# Altium project Bonjour.PrjPcb
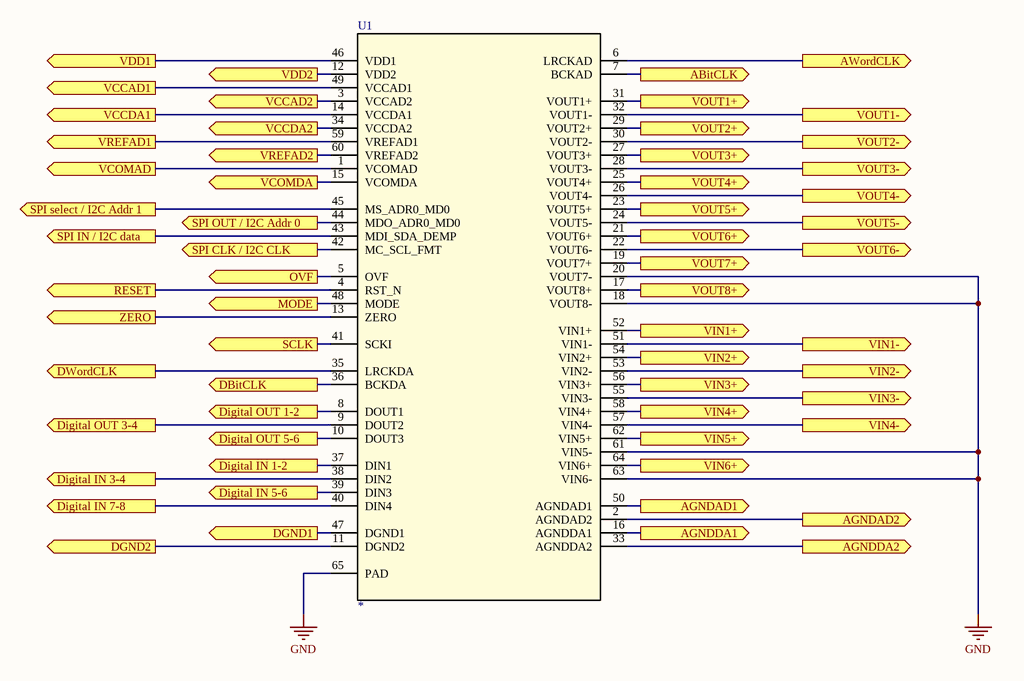
[diagram p0: Sh_ADC-DAC_Main.SchDoc]
4 sheets, 88 parts. Net scope: flat (ports and power ports of the same name join across sheets).
Board file: PCB_Bonjour.PcbDoc
Sheets:
  Sh_ADC-DAC_Main.SchDoc
  Sh_Headers.SchDoc
  Sh_Inputs_Analog.SchDoc
  Sh_Outputs_Analog.SchDoc

## Sheet Sh_ADC-DAC_Main.SchDoc
size A4

### Parts
U1  *  [PAP0064J_N]

### Ports
ABitCLK (out), AGNDAD1 (out), AGNDAD2 (out), AGNDDA1 (out), AGNDDA2 (out), AWordCLK (out), DBitCLK (out), DGND1 (out), DGND2 (out), Digital IN 1-2 (out), Digital IN 3-4 (out), Digital IN 5-6 (out), Digital IN 7-8 (out), Digital OUT 1-2 (out), Digital OUT 3-4 (out), Digital OUT 5-6 (out), DWordCLK (out), MODE (out), OVF (out), RESET (out), SCLK (out), SPI CLK / I2C CLK (out), SPI IN / I2C data (out), SPI OUT / I2C Addr 0 (out), SPI select / I2C Addr 1 (out), VCCAD1 (out), VCCAD2 (out), VCCDA1 (out), VCCDA2 (out), VCOMAD (out), VCOMDA (out), VDD1 (out), VDD2 (out), VIN1+ (out), VIN1- (out), VIN2+ (out), VIN2- (out), VIN3+ (out), VIN3- (out), VIN4+ (out), VIN4- (out), VIN5+ (out), VIN6+ (out), VOUT1+ (out), VOUT1- (out), VOUT2+ (out), VOUT2- (out), VOUT3+ (out), VOUT3- (out), VOUT4+ (out), VOUT4- (out), VOUT5+ (out), VOUT5- (out), VOUT6+ (out), VOUT6- (out), VOUT7+ (out), VOUT8+ (out), VREFAD1 (out), VREFAD2 (out), ZERO (out)

### Nets
GND: U1.18(VOUT8-) U1.20(VOUT7-) U1.61(VIN5-) U1.63(VIN6-) U1.65(PAD)
NetC3_1: U1.52(VIN1+) ; port VIN1+
NetC3_2: U1.51(VIN1-) ; port VIN1-
NetC4_1: U1.54(VIN2+) ; port VIN2+
NetC4_2: U1.53(VIN2-) ; port VIN2-
NetC7#2_1: U1.19(VOUT7+) ; port VOUT7+
NetC8#2_1: U1.17(VOUT8+) ; port VOUT8+
NetC9_1: U1.1(VCOMAD) ; port VCOMAD
NetC13_1: U1.56(VIN3+) ; port VIN3+
NetC13_2: U1.55(VIN3-) ; port VIN3-
NetC15_1: U1.58(VIN4+) ; port VIN4+
NetC15_2: U1.57(VIN4-) ; port VIN4-
NetD27_1: U1.27(VOUT3+) ; port VOUT3+
NetD28_1: U1.25(VOUT4+) ; port VOUT4+
NetD29_1: U1.23(VOUT5+) ; port VOUT5+
NetD30_1: U1.21(VOUT6+) ; port VOUT6+
NetP1_5: U1.7(BCKAD) ; port ABitCLK
NetP1_6: U1.6(LRCKAD) ; port AWordCLK
NetP2_1: U1.37(DIN1) ; port Digital IN 1-2
NetP2_2: U1.38(DIN2) ; port Digital IN 3-4
NetP2_3: U1.39(DIN3) ; port Digital IN 5-6
NetP2_4: U1.40(DIN4) ; port Digital IN 7-8
NetP2_5: U1.36(BCKDA) ; port DBitCLK
NetP2_6: U1.35(LRCKDA) ; port DWordCLK
NetP2_7: U1.8(DOUT1) ; port Digital OUT 1-2
NetP2_8: U1.9(DOUT2) ; port Digital OUT 3-4
NetP2_9: U1.10(DOUT3) ; port Digital OUT 5-6
NetP3_2: U1.62(VIN5+) ; port VIN5+
NetP4_2: U1.64(VIN6+) ; port VIN6+
NetP5_1: U1.5(OVF) ; port OVF
NetP5_2: U1.13(ZERO) ; port ZERO
NetP5_3: U1.4(RST_N) ; port RESET
NetP5_4: U1.48(MODE) ; port MODE
NetP5_5: U1.41(SCKI) ; port SCLK
NetP6_1: U1.45(MS_ADR0_MD0) ; port SPI select / I2C Addr 1
NetP6_2: U1.44(MDO_ADR0_MD0) ; port SPI OUT / I2C Addr 0
NetP6_3: U1.43(MDI_SDA_DEMP) ; port SPI IN / I2C data
NetP6_4: U1.42(MC_SCL_FMT) ; port SPI CLK / I2C CLK
NetR26_1: U1.32(VOUT1-) ; port VOUT1-
NetR29_1: U1.31(VOUT1+) ; port VOUT1+
NetR34_1: U1.30(VOUT2-) ; port VOUT2-
NetR36_1: U1.29(VOUT2+) ; port VOUT2+
NetU1_2: U1.2(AGNDAD2) ; port AGNDAD2
NetU1_3: U1.3(VCCAD2) ; port VCCAD2
NetU1_11: U1.11(DGND2) ; port DGND2
NetU1_12: U1.12(VDD2) ; port VDD2
NetU1_14: U1.14(VCCDA1) ; port VCCDA1
NetU1_15: U1.15(VCOMDA) ; port VCOMDA
NetU1_16: U1.16(AGNDDA1) ; port AGNDDA1
NetU1_22: U1.22(VOUT6-) ; port VOUT6-
NetU1_24: U1.24(VOUT5-) ; port VOUT5-
NetU1_26: U1.26(VOUT4-) ; port VOUT4-
NetU1_28: U1.28(VOUT3-) ; port VOUT3-
NetU1_33: U1.33(AGNDDA2) ; port AGNDDA2
NetU1_34: U1.34(VCCDA2) ; port VCCDA2
NetU1_46: U1.46(VDD1) ; port VDD1
NetU1_47: U1.47(DGND1) ; port DGND1
NetU1_49: U1.49(VCCAD1) ; port VCCAD1
NetU1_50: U1.50(AGNDAD1) ; port AGNDAD1
NetU1_59: U1.59(VREFAD1) ; port VREFAD1
NetU1_60: U1.60(VREFAD2) ; port VREFAD2

### Notes on the sheet
- (in symbol PCM3168APAPR) DAC; ADC

### Library data of the parts
U1 = PCM3168APAPR: Imported; Manufacturer: Texas Instruments; PartNumber: PCM3168APAPR; RefDes: RefDes; TYPE: TYPE; Value: Value

## Sheet Sh_Headers.SchDoc
size A4
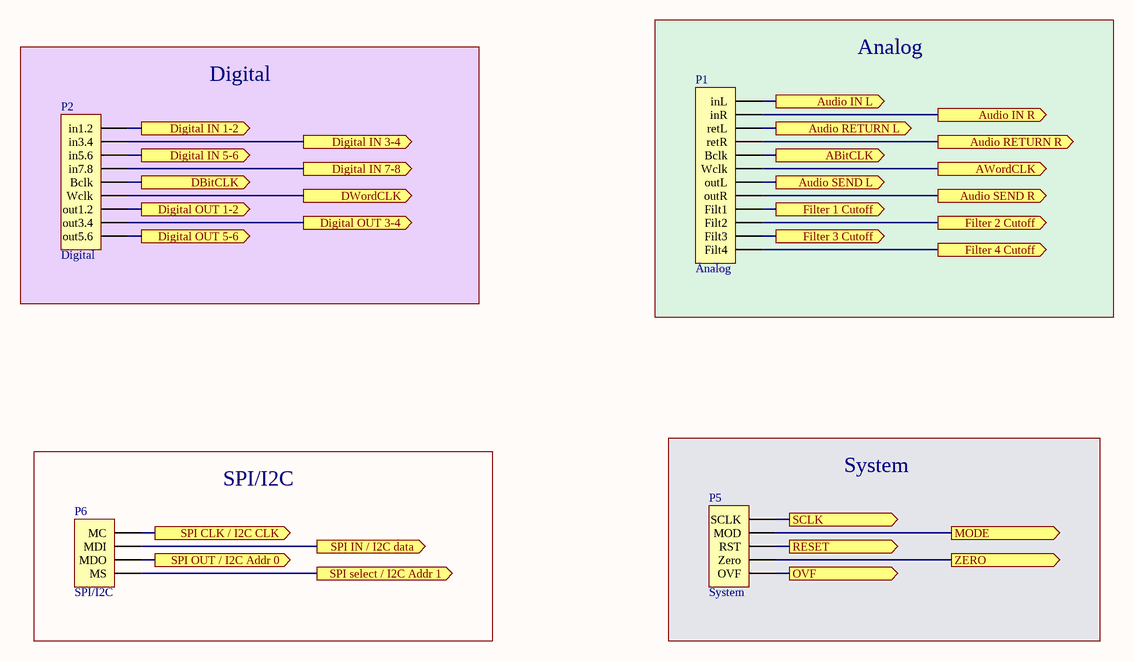
[diagram p1: Sh_Headers.SchDoc]

### Parts
P1  Analog  [HDR1X12]
P2  Digital  [HDR1X9]
P5  System  [HDR1X5]
P6  SPI/I2C  [HDR1X4]

### Blocks framed on the sheet
Digital: P2
Analog: P1
SPI/I2C: P6
System: P5

### Ports
ABitCLK (out), Audio IN L (out), Audio IN R (out), Audio RETURN L (out), Audio RETURN R (out), Audio SEND L (out), Audio SEND R (out), AWordCLK (out), DBitCLK (out), Digital IN 1-2 (out), Digital IN 3-4 (out), Digital IN 5-6 (out), Digital IN 7-8 (out), Digital OUT 1-2 (out), Digital OUT 3-4 (out), Digital OUT 5-6 (out), DWordCLK (out), Filter 1 Cutoff (out), Filter 2 Cutoff (out), Filter 3 Cutoff (out), Filter 4 Cutoff (out), MODE (out), OVF (out), RESET (out), SCLK (out), SPI CLK / I2C CLK (out), SPI IN / I2C data (out), SPI OUT / I2C Addr 0 (out), SPI select / I2C Addr 1 (out), ZERO (out)

### Nets
NetC7#1_2: P1.1(inL) ; port Audio IN L
NetC8#1_2: P1.2(inR) ; port Audio IN R
NetC14_2: P1.4(retR) ; port Audio RETURN R
NetC18_2: P1.3(retL) ; port Audio RETURN L
NetP1_5: P1.5(Bclk) ; port ABitCLK
NetP1_6: P1.6(Wclk) ; port AWordCLK
NetP1_7: P1.7(outL) ; port Audio SEND L
NetP1_8: P1.8(outR) ; port Audio SEND R
NetP1_9: P1.9(Filt1) ; port Filter 1 Cutoff
NetP1_10: P1.10(Filt2) ; port Filter 2 Cutoff
NetP1_11: P1.11(Filt3) ; port Filter 3 Cutoff
NetP1_12: P1.12(Filt4) ; port Filter 4 Cutoff
NetP2_1: P2.1(in1.2) ; port Digital IN 1-2
NetP2_2: P2.2(in3.4) ; port Digital IN 3-4
NetP2_3: P2.3(in5.6) ; port Digital IN 5-6
NetP2_4: P2.4(in7.8) ; port Digital IN 7-8
NetP2_5: P2.5(Bclk) ; port DBitCLK
NetP2_6: P2.6(Wclk) ; port DWordCLK
NetP2_7: P2.7(out1.2) ; port Digital OUT 1-2
NetP2_8: P2.8(out3.4) ; port Digital OUT 3-4
NetP2_9: P2.9(out5.6) ; port Digital OUT 5-6
NetP5_1: P5.1(OVF) ; port OVF
NetP5_2: P5.2(Zero) ; port ZERO
NetP5_3: P5.3(RST) ; port RESET
NetP5_4: P5.4(MOD) ; port MODE
NetP5_5: P5.5(SCLK) ; port SCLK
NetP6_1: P6.1(MS) ; port SPI select / I2C Addr 1
NetP6_2: P6.2(MDO) ; port SPI OUT / I2C Addr 0
NetP6_3: P6.3(MDI) ; port SPI IN / I2C data
NetP6_4: P6.4(MC) ; port SPI CLK / I2C CLK

### Library data of the parts
P1 = Header 12: Header, 12-Pin; LatestRevisionDate: 17-Jul-2002; LatestRevisionNote: Re-released for DXP Platform.; Publisher: Altium Limited
P2 = Header 9: Header, 9-Pin; LatestRevisionDate: 17-Jul-2002; LatestRevisionNote: Re-released for DXP Platform.; Publisher: Altium Limited
P5 = Header 5: Header, 5-Pin; LatestRevisionDate: 17-Jul-2002; LatestRevisionNote: Re-released for DXP Platform.; Publisher: Altium Limited
P6 = Header 4: Header, 4-Pin; LatestRevisionDate: 17-Jul-2002; LatestRevisionNote: Re-released for DXP Platform.; Publisher: Altium Limited

## Sheet Sh_Inputs_Analog.SchDoc
size A3
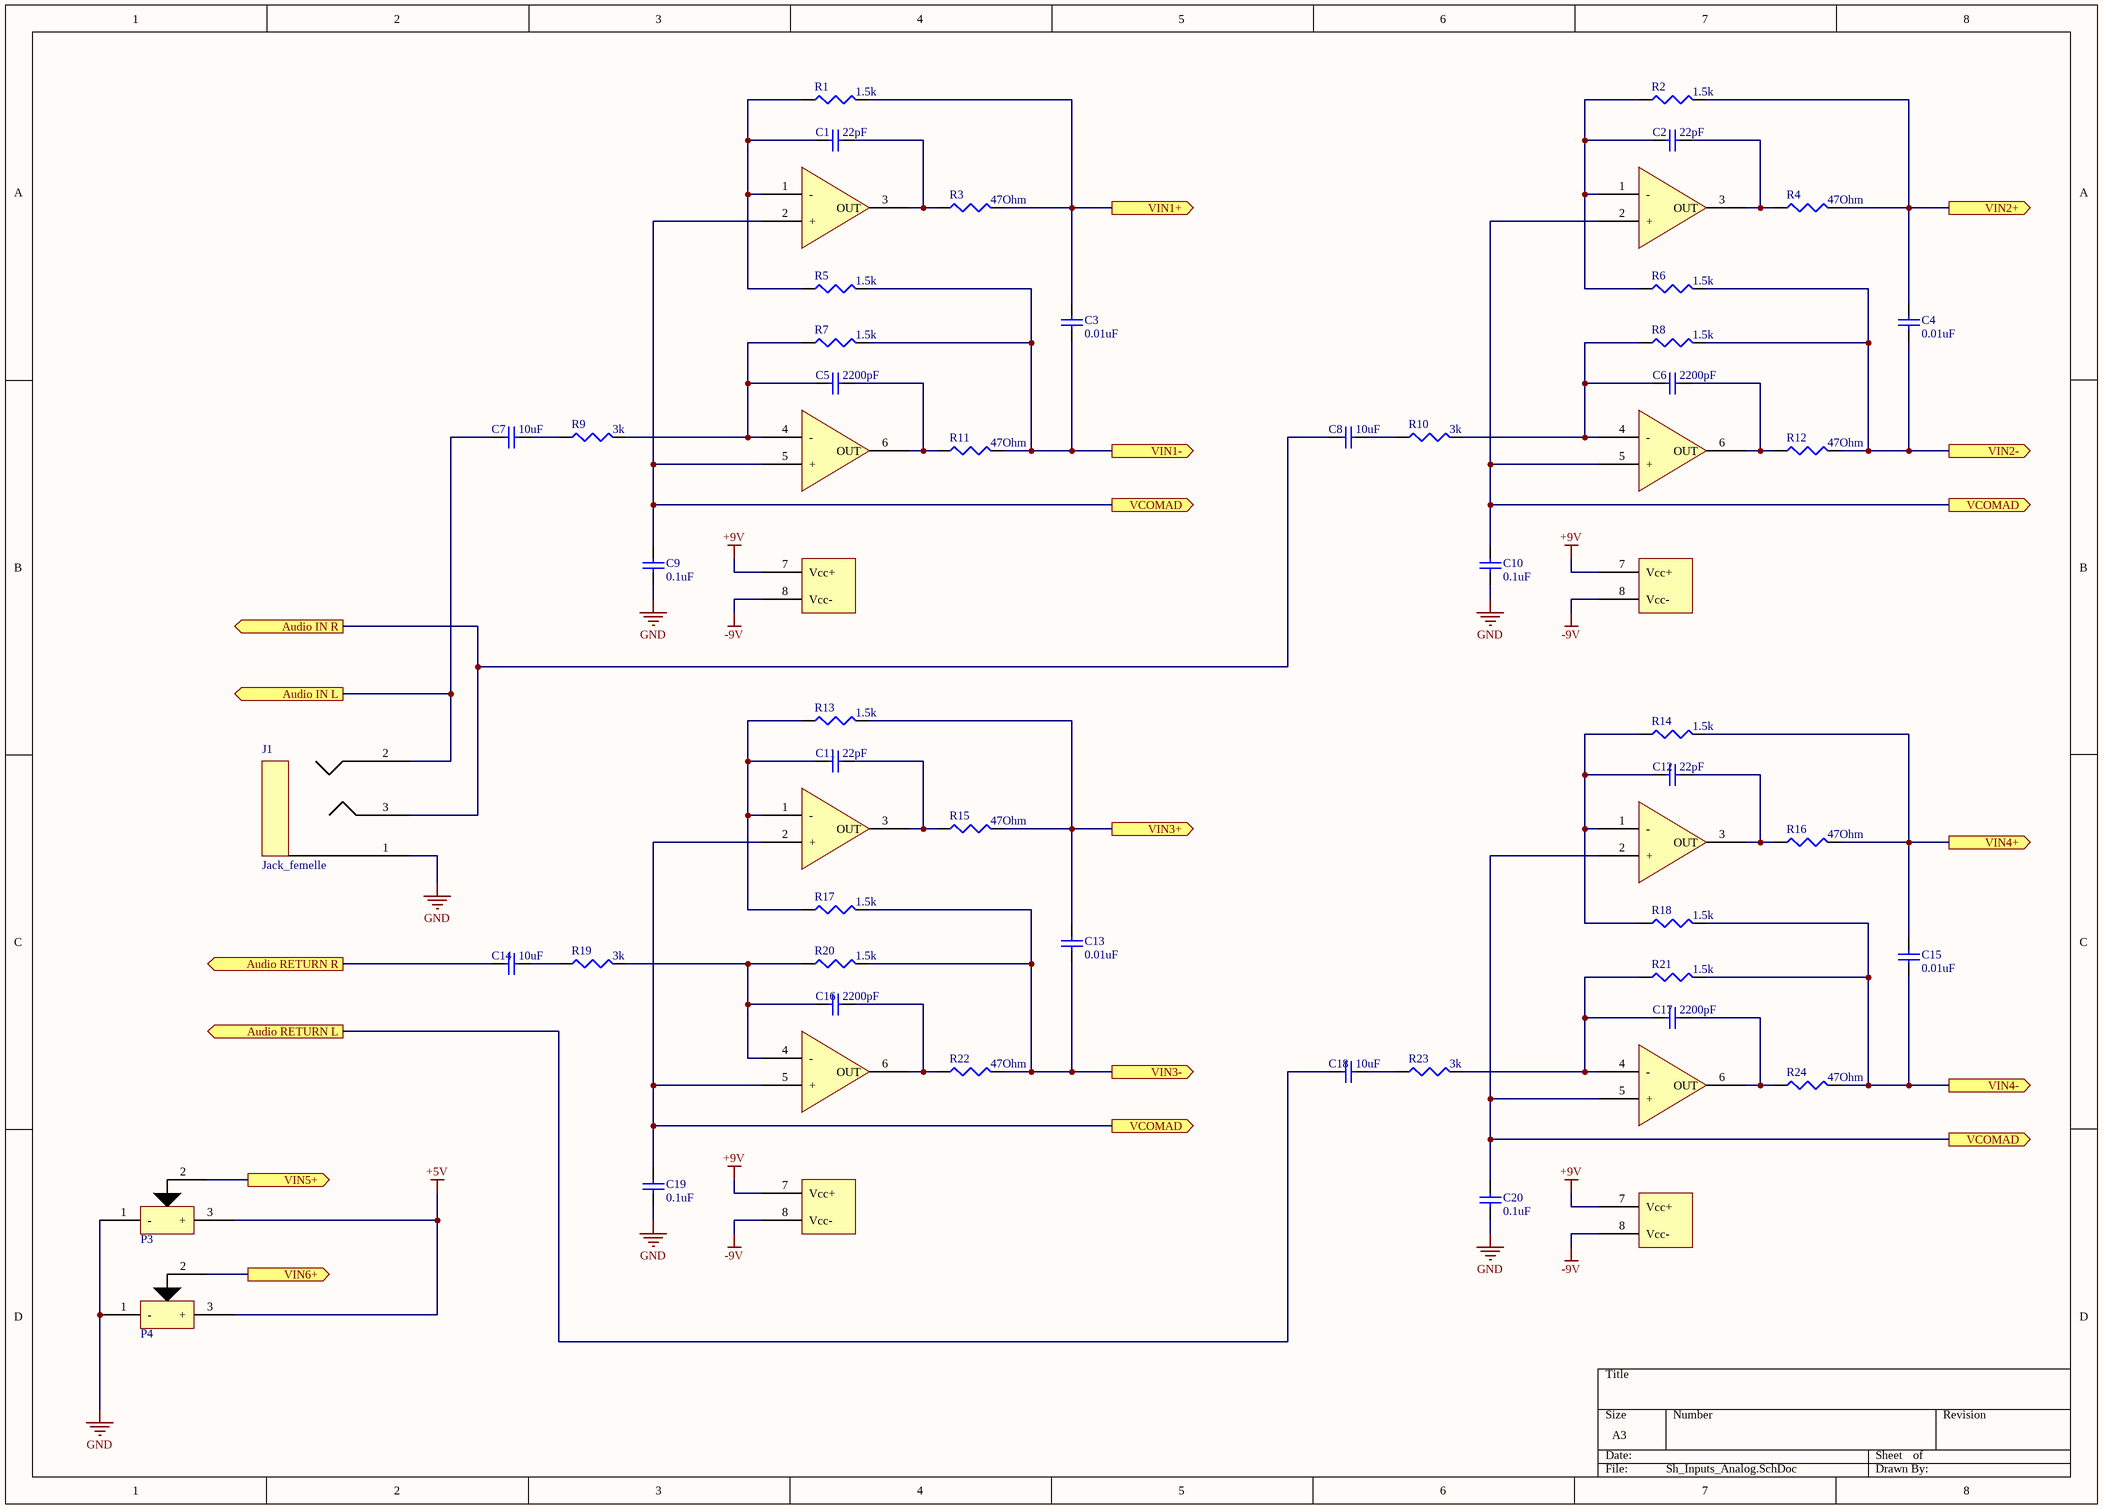
[diagram p2: Sh_Inputs_Analog.SchDoc]

### Parts
(Parts that share a designator on the sheet are numbered #1, #2 ... from top to bottom, then left to right.)
C1  value 22pF  [1608[0603]]  (hidden comment: Cap Semi)
C2  value 22pF  [1608[0603]]  (hidden comment: Cap Semi)
C3  value 0.01uF  [1608[0603]]  (hidden comment: Cap Semi)
C4  value 0.01uF  [1608[0603]]  (hidden comment: Cap Semi)
C5  value 2200pF  [1608[0603]]  (hidden comment: Cap Semi)
C6  value 2200pF  [1608[0603]]  (hidden comment: Cap Semi)
C7#1  value 10uF  [1608[0603]]  (hidden comment: Cap Semi)
C8#1  value 10uF  [1608[0603]]  (hidden comment: Cap Semi)
C9  value 0.1uF  [1608[0603]]  (hidden comment: Cap Semi)
C10  value 0.1uF  [1608[0603]]  (hidden comment: Cap Semi)
C11  value 22pF  [1608[0603]]  (hidden comment: Cap Semi)
C12  value 22pF  [1608[0603]]  (hidden comment: Cap Semi)
C13  value 0.01uF  [1608[0603]]  (hidden comment: Cap Semi)
C14  value 10uF  [1608[0603]]  (hidden comment: Cap Semi)
C15  value 0.01uF  [1608[0603]]  (hidden comment: Cap Semi)
C16  value 2200pF  [1608[0603]]  (hidden comment: Cap Semi)
C17  value 2200pF  [1608[0603]]  (hidden comment: Cap Semi)
C18  value 10uF  [1608[0603]]  (hidden comment: Cap Semi)
C19  value 0.1uF  [1608[0603]]  (hidden comment: Cap Semi)
C20  value 0.1uF  [1608[0603]]  (hidden comment: Cap Semi)
J1  Jack_femelle  [Jack_Femelle]
P3  Potentiomètre  [Trimmer]  (value not drawn)
P4  Potentiomètre  [Trimmer]  (value not drawn)
R1  value 1.5k  [J1-0603]  (hidden comment: Res3)
R2  value 1.5k  [J1-0603]  (hidden comment: Res3)
R3  value 47Ohm  [J1-0603]  (hidden comment: Res3)
R4  value 47Ohm  [J1-0603]  (hidden comment: Res3)
R5  value 1.5k  [J1-0603]  (hidden comment: Res3)
R6  value 1.5k  [J1-0603]  (hidden comment: Res3)
R7  value 1.5k  [J1-0603]  (hidden comment: Res3)
R8  value 1.5k  [J1-0603]  (hidden comment: Res3)
R9  value 3k  [J1-0603]  (hidden comment: Res3)
R10  value 3k  [J1-0603]  (hidden comment: Res3)
R11  value 47Ohm  [J1-0603]  (hidden comment: Res3)
R12  value 47Ohm  [J1-0603]  (hidden comment: Res3)
R13  value 1.5k  [J1-0603]  (hidden comment: Res3)
R14  value 1.5k  [J1-0603]  (hidden comment: Res3)
R15  value 47Ohm  [J1-0603]  (hidden comment: Res3)
R16  value 47Ohm  [J1-0603]  (hidden comment: Res3)
R17  value 1.5k  [J1-0603]  (hidden comment: Res3)
R18  value 1.5k  [J1-0603]  (hidden comment: Res3)
R19  value 3k  [J1-0603]  (hidden comment: Res3)
R20  value 1.5k  [J1-0603]  (hidden comment: Res3)
R21  value 1.5k  [J1-0603]  (hidden comment: Res3)
R22  value 47Ohm  [J1-0603]  (hidden comment: Res3)
R23  value 3k  [J1-0603]  (hidden comment: Res3)
R24  value 47Ohm  [J1-0603]  (hidden comment: Res3)
U2  Ampli_op  (value not drawn)
U3  Ampli_op  (value not drawn)
U4  Ampli_op  (value not drawn)
U5  Ampli_op  (value not drawn)

### Ports
Audio IN L (out), Audio IN R (out), Audio RETURN L (out), Audio RETURN R (out), VCOMAD (out), VIN1+ (out), VIN1- (out), VIN2+ (out), VIN2- (out), VIN3+ (out), VIN3- (out), VIN4+ (out), VIN4- (out), VIN5+ (out), VIN6+ (out)

### Nets
+5V: P3.3(+) P4.3(+)
+9V: U2.7(Vcc+) U3.7(Vcc+) U4.7(Vcc+) U5.7(Vcc+)
-9V: U2.8(Vcc-) U3.8(Vcc-) U4.8(Vcc-) U5.8(Vcc-)
GND: C9.2 C10.2 C19.2 C20.2 J1.1(GND) P3.1(-) P4.1(-)
NetC1_1: C1.1 R3.1 U2.3(OUT)
NetC1_2: C1.2 R1.1 R5.1 U2.1(-)
NetC2_1: C2.1 R4.1 U3.3(OUT)
NetC2_2: C2.2 R2.1 R6.1 U3.1(-)
NetC3_1: C3.1 R1.2 R3.2 ; port VIN1+
NetC3_2: C3.2 R5.2 R7.2 R11.2 ; port VIN1-
NetC4_1: C4.1 R2.2 R4.2 ; port VIN2+
NetC4_2: C4.2 R6.2 R8.2 R12.2 ; port VIN2-
NetC5_1: C5.1 R11.1 U2.6(OUT)
NetC5_2: C5.2 R7.1 R9.2 U2.4(-)
NetC6_1: C6.1 R12.1 U3.6(OUT)
NetC6_2: C6.2 R8.1 R10.2 U3.4(-)
NetC7#1_1: C7#1.1 R9.1
NetC7#1_2: C7#1.2 J1.2(L) ; port Audio IN L
NetC8#1_1: C8#1.1 R10.1
NetC8#1_2: C8#1.2 J1.3(R) ; port Audio IN R
NetC9_1: C9.1 C10.1 C19.1 C20.1 U2.2(+) U2.5(+) U3.2(+) U3.5(+) U4.2(+) U4.5(+) U5.2(+) U5.5(+) ; port VCOMAD
NetC11_1: C11.1 R15.1 U4.3(OUT)
NetC11_2: C11.2 R13.1 R17.1 U4.1(-)
NetC12_1: C12.1 R16.1 U5.3(OUT)
NetC12_2: C12.2 R14.1 R18.1 U5.1(-)
NetC13_1: C13.1 R13.2 R15.2 ; port VIN3+
NetC13_2: C13.2 R17.2 R20.2 R22.2 ; port VIN3-
NetC14_1: C14.1 R19.1
NetC14_2: C14.2 ; port Audio RETURN R
NetC15_1: C15.1 R14.2 R16.2 ; port VIN4+
NetC15_2: C15.2 R18.2 R21.2 R24.2 ; port VIN4-
NetC16_1: C16.1 R22.1 U4.6(OUT)
NetC16_2: C16.2 R19.2 R20.1 U4.4(-)
NetC17_1: C17.1 R24.1 U5.6(OUT)
NetC17_2: C17.2 R21.1 R23.2 U5.4(-)
NetC18_1: C18.1 R23.1
NetC18_2: C18.2 ; port Audio RETURN L
NetP3_2: P3.2(RD) ; port VIN5+
NetP4_2: P4.2(RD) ; port VIN6+

### Library data of the parts
C1-C6 C7#1 C8#1 C9-C20 = Cap Semi: Capacitor (Semiconductor SIM Model); Published: 8-Jun-2000; LatestRevisionDate: 29-May-2009; LatestRevisionNote: IPC-7351 Footprint Added.; PackageReference: C1206; Publisher: Altium Limited; PackageDescription: Chip Capacitor
R1-R24 = Res3: Resistor; Published: 8-Jun-2000; LatestRevisionDate: 29-May-2009; LatestRevisionNote: IPC-7351 Footprint Added.; PackageReference: J1-0603; Publisher: Altium Limited; PackageDescription: Chip Resistor

## Sheet Sh_Outputs_Analog.SchDoc
size A4
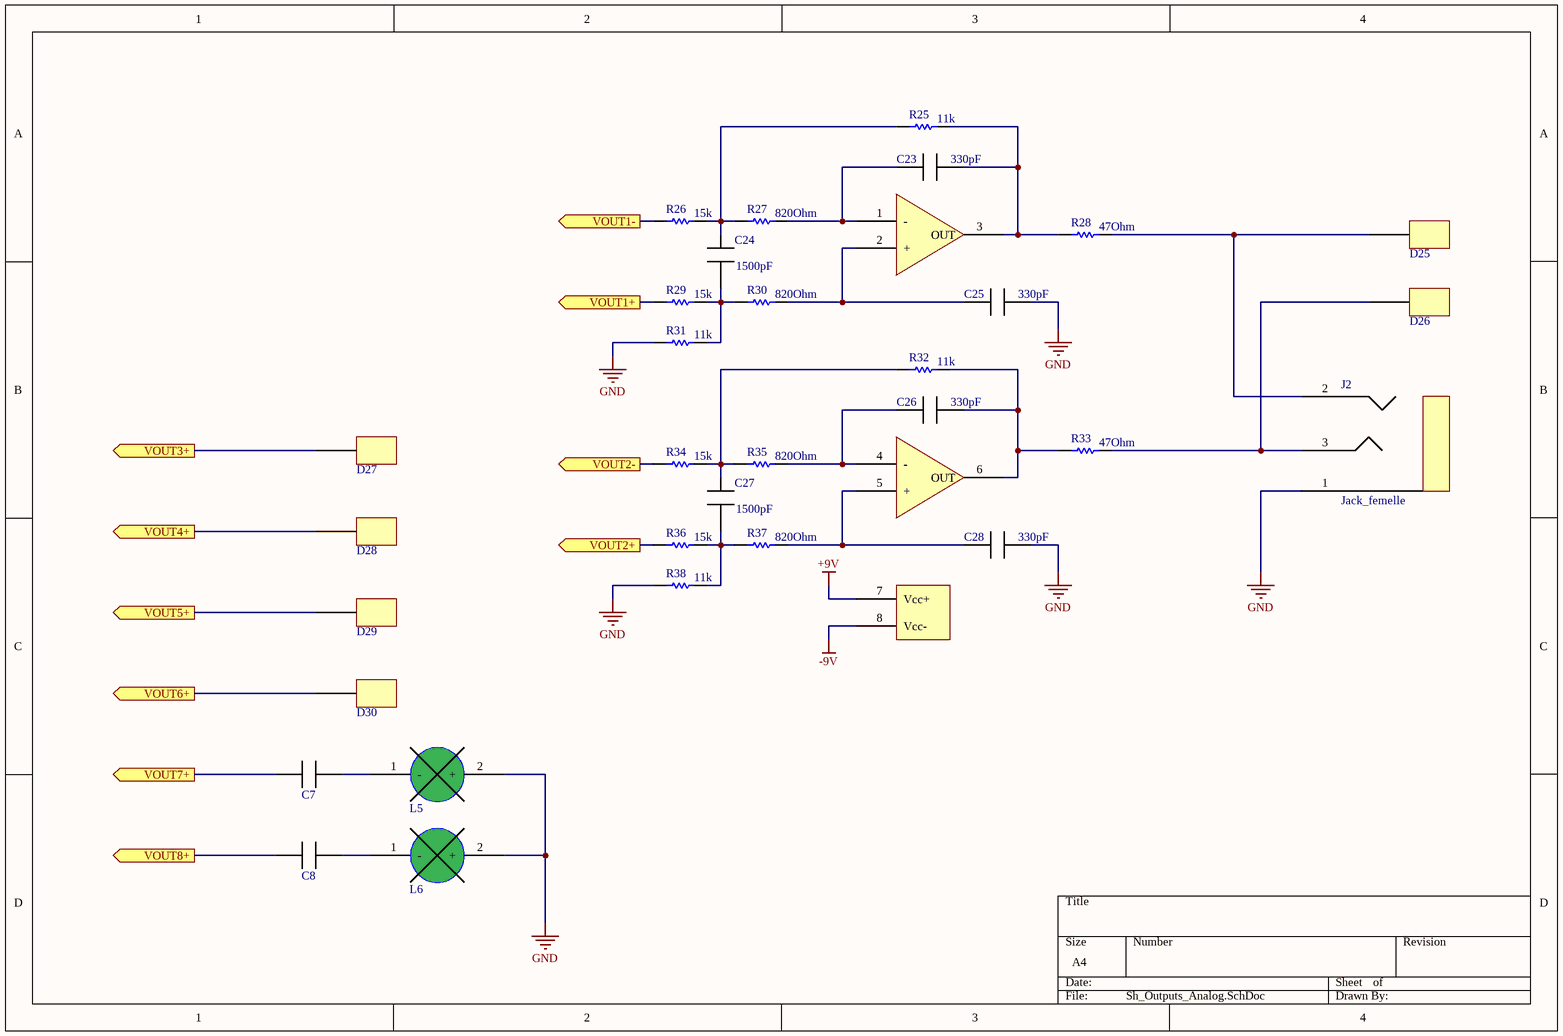
[diagram p3: Sh_Outputs_Analog.SchDoc]

### Parts
(Parts that share a designator on the sheet are numbered #1, #2 ... from top to bottom, then left to right.)
C7#2  Condo  [Condo]  (value not drawn)
C8#2  Condo  [Condo]  (value not drawn)
C23  330pF  [Condo]
C24  1500pF  [Condo]
C25  330pF  [Condo]
C26  330pF  [Condo]
C27  1500pF  [Condo]
C28  330pF  [Condo]
D25  Pad  [Pad]  (value not drawn)
D26  Pad  [Pad]  (value not drawn)
D27  Pad  [Pad]  (value not drawn)
D28  Pad  [Pad]  (value not drawn)
D29  Pad  [Pad]  (value not drawn)
D30  Pad  [Pad]  (value not drawn)
J2  Jack_femelle  [Jack_Femelle]
L5  Led  [Led]  (value not drawn)
L6  Led  [Led]  (value not drawn)
R25  value 11k  [AXIAL-0.5]  (hidden comment: 10uF)
R26  value 15k  [AXIAL-0.5]  (hidden comment: 10uF)
R27  value 820Ohm  [AXIAL-0.5]  (hidden comment: 10uF)
R28  value 47Ohm  [AXIAL-0.5]  (hidden comment: 10uF)
R29  value 15k  [AXIAL-0.5]  (hidden comment: 10uF)
R30  value 820Ohm  [AXIAL-0.5]  (hidden comment: 10uF)
R31  value 11k  [AXIAL-0.5]  (hidden comment: 10uF)
R32  value 11k  [AXIAL-0.5]  (hidden comment: 10uF)
R33  value 47Ohm  [AXIAL-0.5]  (hidden comment: 10uF)
R34  value 15k  [AXIAL-0.5]  (hidden comment: 10uF)
R35  value 820Ohm  [AXIAL-0.5]  (hidden comment: 10uF)
R36  value 15k  [AXIAL-0.5]  (hidden comment: 10uF)
R37  value 820Ohm  [AXIAL-0.5]  (hidden comment: 10uF)
R38  value 11k  [AXIAL-0.5]  (hidden comment: 10uF)
U6  Ampli_op  (value not drawn)

### Ports
VOUT1+ (out), VOUT1- (out), VOUT2+ (out), VOUT2- (out), VOUT3+ (out), VOUT4+ (out), VOUT5+ (out), VOUT6+ (out), VOUT7+ (out), VOUT8+ (out)

### Nets
+9V: U6.7(Vcc+)
-9V: U6.8(Vcc-)
GND: C25.2(k) C28.2(k) J2.1(GND) L5.2(+) L6.2(+) R31.1 R38.1
NetC7#2_1: C7#2.1(k) ; port VOUT7+
NetC7#2_2: C7#2.2(k) L5.1(-)
NetC8#2_1: C8#2.1(k) ; port VOUT8+
NetC8#2_2: C8#2.2(k) L6.1(-)
NetC23_1: C23.1(k) R27.2 U6.1(-)
NetC23_2: C23.2(k) R25.2 R28.1 U6.3(OUT)
NetC24_1: C24.1(k) R29.2 R30.1 R31.2
NetC24_2: C24.2(k) R25.1 R26.2 R27.1
NetC25_1: C25.1(k) R30.2 U6.2(+)
NetC26_1: C26.1(k) R35.2 U6.4(-)
NetC26_2: C26.2(k) R32.2 R33.1 U6.6(OUT)
NetC27_1: C27.1(k) R36.2 R37.1 R38.2
NetC27_2: C27.2(k) R32.1 R34.2 R35.1
NetC28_1: C28.1(k) R37.2 U6.5(+)
NetD25_1: D25.1 J2.2(L) R28.2
NetD26_1: D26.1 J2.3(R) R33.2
NetD27_1: D27.1 ; port VOUT3+
NetD28_1: D28.1 ; port VOUT4+
NetD29_1: D29.1 ; port VOUT5+
NetD30_1: D30.1 ; port VOUT6+
NetR26_1: R26.1 ; port VOUT1-
NetR29_1: R29.1 ; port VOUT1+
NetR34_1: R34.1 ; port VOUT2-
NetR36_1: R36.1 ; port VOUT2+

### Library data of the parts
C23-C28 = Condo
R25-R38 = Res Semi: Semiconductor Resistor; Published: 8-Jun-2000; LatestRevisionDate: 17-Jul-2002; LatestRevisionNote: Re-released for DXP Platform.; PackageReference: AXIAL-0.5; Publisher: Altium Limited; PackageDescription: Axial Device, Thru-Hole; 2 Leads; 0.5 in Pin Spacing

## Nets that join several sheets
+9V: Sh_Inputs_Analog (U2.7 U3.7 U4.7 U5.7), Sh_Outputs_Analog (U6.7)
-9V: Sh_Inputs_Analog (U2.8 U3.8 U4.8 U5.8), Sh_Outputs_Analog (U6.8)
GND: Sh_ADC-DAC_Main (5 pins), Sh_Inputs_Analog (7 pins), Sh_Outputs_Analog (7 pins)
NetC3_1: Sh_ADC-DAC_Main (U1.52), Sh_Inputs_Analog (C3.1 R1.2 R3.2)
NetC3_2: Sh_ADC-DAC_Main (U1.51), Sh_Inputs_Analog (C3.2 R5.2 R7.2 R11.2)
NetC4_1: Sh_ADC-DAC_Main (U1.54), Sh_Inputs_Analog (C4.1 R2.2 R4.2)
NetC4_2: Sh_ADC-DAC_Main (U1.53), Sh_Inputs_Analog (C4.2 R6.2 R8.2 R12.2)
NetC7#1_2: Sh_Headers (P1.1), Sh_Inputs_Analog (C7#1.2 J1.2)
NetC7#2_1: Sh_ADC-DAC_Main (U1.19), Sh_Outputs_Analog (C7#2.1)
NetC8#1_2: Sh_Headers (P1.2), Sh_Inputs_Analog (C8#1.2 J1.3)
NetC8#2_1: Sh_ADC-DAC_Main (U1.17), Sh_Outputs_Analog (C8#2.1)
NetC9_1: Sh_ADC-DAC_Main (U1.1), Sh_Inputs_Analog (12 pins)
NetC13_1: Sh_ADC-DAC_Main (U1.56), Sh_Inputs_Analog (C13.1 R13.2 R15.2)
NetC13_2: Sh_ADC-DAC_Main (U1.55), Sh_Inputs_Analog (C13.2 R17.2 R20.2 R22.2)
NetC14_2: Sh_Headers (P1.4), Sh_Inputs_Analog (C14.2)
NetC15_1: Sh_ADC-DAC_Main (U1.58), Sh_Inputs_Analog (C15.1 R14.2 R16.2)
NetC15_2: Sh_ADC-DAC_Main (U1.57), Sh_Inputs_Analog (C15.2 R18.2 R21.2 R24.2)
NetC18_2: Sh_Headers (P1.3), Sh_Inputs_Analog (C18.2)
NetD27_1: Sh_ADC-DAC_Main (U1.27), Sh_Outputs_Analog (D27.1)
NetD28_1: Sh_ADC-DAC_Main (U1.25), Sh_Outputs_Analog (D28.1)
NetD29_1: Sh_ADC-DAC_Main (U1.23), Sh_Outputs_Analog (D29.1)
NetD30_1: Sh_ADC-DAC_Main (U1.21), Sh_Outputs_Analog (D30.1)
NetP1_5: Sh_ADC-DAC_Main (U1.7), Sh_Headers (P1.5)
NetP1_6: Sh_ADC-DAC_Main (U1.6), Sh_Headers (P1.6)
NetP2_1: Sh_ADC-DAC_Main (U1.37), Sh_Headers (P2.1)
NetP2_2: Sh_ADC-DAC_Main (U1.38), Sh_Headers (P2.2)
NetP2_3: Sh_ADC-DAC_Main (U1.39), Sh_Headers (P2.3)
NetP2_4: Sh_ADC-DAC_Main (U1.40), Sh_Headers (P2.4)
NetP2_5: Sh_ADC-DAC_Main (U1.36), Sh_Headers (P2.5)
NetP2_6: Sh_ADC-DAC_Main (U1.35), Sh_Headers (P2.6)
NetP2_7: Sh_ADC-DAC_Main (U1.8), Sh_Headers (P2.7)
NetP2_8: Sh_ADC-DAC_Main (U1.9), Sh_Headers (P2.8)
NetP2_9: Sh_ADC-DAC_Main (U1.10), Sh_Headers (P2.9)
NetP3_2: Sh_ADC-DAC_Main (U1.62), Sh_Inputs_Analog (P3.2)
NetP4_2: Sh_ADC-DAC_Main (U1.64), Sh_Inputs_Analog (P4.2)
NetP5_1: Sh_ADC-DAC_Main (U1.5), Sh_Headers (P5.1)
NetP5_2: Sh_ADC-DAC_Main (U1.13), Sh_Headers (P5.2)
NetP5_3: Sh_ADC-DAC_Main (U1.4), Sh_Headers (P5.3)
NetP5_4: Sh_ADC-DAC_Main (U1.48), Sh_Headers (P5.4)
NetP5_5: Sh_ADC-DAC_Main (U1.41), Sh_Headers (P5.5)
NetP6_1: Sh_ADC-DAC_Main (U1.45), Sh_Headers (P6.1)
NetP6_2: Sh_ADC-DAC_Main (U1.44), Sh_Headers (P6.2)
NetP6_3: Sh_ADC-DAC_Main (U1.43), Sh_Headers (P6.3)
NetP6_4: Sh_ADC-DAC_Main (U1.42), Sh_Headers (P6.4)
NetR26_1: Sh_ADC-DAC_Main (U1.32), Sh_Outputs_Analog (R26.1)
NetR29_1: Sh_ADC-DAC_Main (U1.31), Sh_Outputs_Analog (R29.1)
NetR34_1: Sh_ADC-DAC_Main (U1.30), Sh_Outputs_Analog (R34.1)
NetR36_1: Sh_ADC-DAC_Main (U1.29), Sh_Outputs_Analog (R36.1)